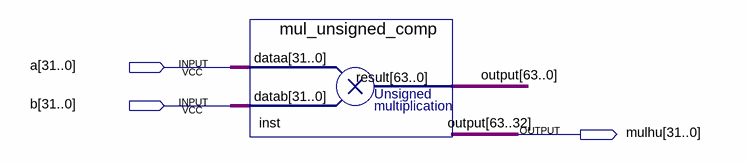
[diagram p0: schematic sheet]
// Quartus schematic mulhu.bdf as structural Verilog: 1 symbols, 3 pins
module mulhu (
  input  [31:0] a,
  input  [31:0] b,
  output [31:0] mulhu
);

  wire [31:0] \output ;

  mul_unsigned_comp inst (.dataa(a), .datab(b), .result({mulhu, \output }));

  // Other names for the same wires on the sheet: output[63:32] = mulhu
endmodule
